# Altium schematic sheet Microcontrolador.SchDoc
size Legal; SheetNumber: 3; SheetTotal: 8
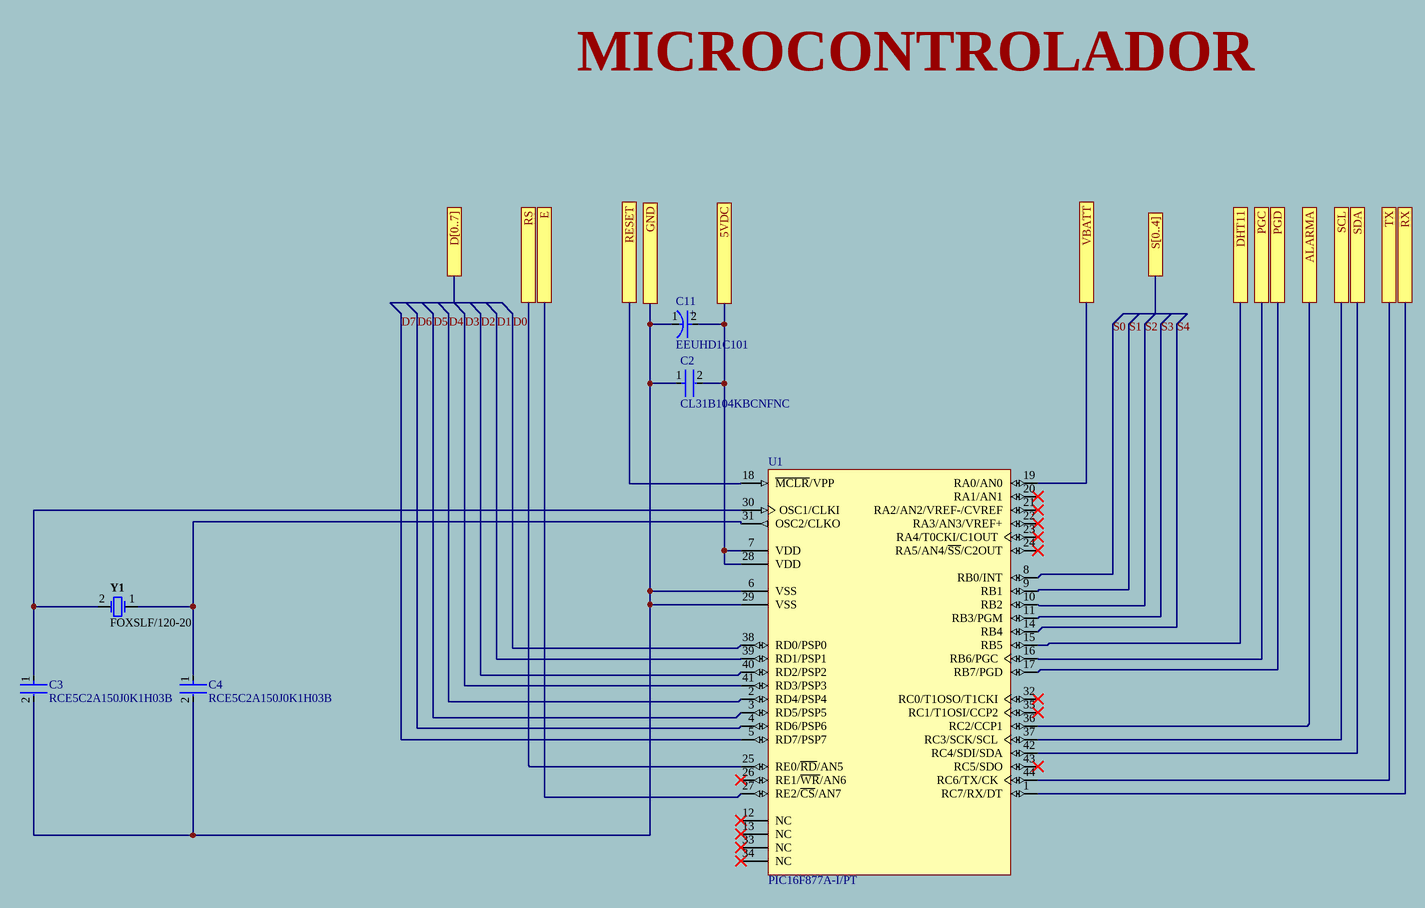
[diagram p0: Microcontrolador.SchDoc]

## Parts
C2  CL31B104KBCNFNC  [FP-CL31-IPC_C]
C3  RCE5C2A150J0K1H03B  [FP-RCE0K1-MFG]
C4  RCE5C2A150J0K1H03B  [FP-RCE0K1-MFG]
C11  EEUHD1C101  [FP-RAD-TH-D_5_0_5-L_11_1-MFG]
U1  PIC16F877A-I/PT  [TQFP-PT44_M]
Y1  FOXSLF/120-20  [FOX-FOXSLF-2_V]

## Ports
5VDC, ALARMA, D[0..7], DHT11, E, GND, PGC, PGD, RESET, RS, RX, S[0..4], SCL, SDA, TX, VBATT

## Nets
5VDC: C2.2 C11.2(A) U1.7(VDD) U1.28(VDD) ; port 5VDC
ALARMA: U1.36(RC2/CCP1) ; port ALARMA
D0: U1.38(RD0/PSP0)
D1: U1.39(RD1/PSP1)
D2: U1.40(RD2/PSP2)
D3: U1.41(RD3/PSP3)
D4: U1.2(RD4/PSP4)
D5: U1.3(RD5/PSP5)
D6: U1.4(RD6/PSP6)
D7: U1.5(RD7/PSP7)
DHT11: U1.15(RB5) ; port DHT11
E: U1.27(RE2/~{CS}/AN7) ; port E
GND: C2.1 C3.2 C4.2 C11.1(C) U1.6(VSS) U1.29(VSS) ; port GND
PGC: U1.16(RB6/PGC) ; port PGC
PGD: U1.17(RB7/PGD) ; port PGD
RESET: U1.18(~{MCLR}/VPP) ; port RESET
RS: U1.25(RE0/~{RD}/AN5) ; port RS
RX: U1.1(RC7/RX/DT) ; port RX
S0: U1.8(RB0/INT)
S1: U1.9(RB1)
S2: U1.10(RB2)
S3: U1.11(RB3/PGM)
S4: U1.14(RB4)
SCL: U1.37(RC3/SCK/SCL) ; port SCL
SDA: U1.42(RC4/SDI/SDA) ; port SDA
TX: U1.44(RC6/TX/CK) ; port TX
VBATT: U1.19(RA0/AN0) ; port VBATT
NetC3_1: C3.1 U1.30(OSC1/CLKI) Y1.2
NetC4_1: C4.1 U1.31(OSC2/CLKO) Y1.1

Not connected (* = marked no-connect by the designer): U1 12(NC)* 13(NC)* 20(RA1/AN1)* 21(RA2/AN2/VREF-/CVREF)* 22(RA3/AN3/VREF+)* 23(RA4/T0CKI/C1OUT)* 24(RA5/AN4/~{SS}/C2OUT)* 26(RE1/~{WR}/AN6)* 32(RC0/T1OSO/T1CKI)* 33(NC)* 34(NC)* 35(RC1/T1OSI/CCP2)* 43(RC5/SDO)*

## Notes on the sheet
- MICROCONTROLADOR
- (in symbol CMP-05427-000949-1) +

## Library data of the parts
C2 = CMP-13271-001276-1: Cap Ceramic 100nF 50V X7R ±10% SMD 1206 +125°C Embossed T/R; Dielectric: X7R; Case Code (Metric): 3216; Package Quantity: 1; Thickness: 0.037inch; Depth: 1.6mm; Packaging: Tape and Reel; Capacitance: 100nF; Length: 0.126inch; Tolerance: 10%; Voltage Rating: 50V; Case Code (Imperial): 1206; Radiation Hardening: No; Width: 0.063inch; Case/Package: 1206; Max Operating Temperature: 125°C; Min Operating Temperature: -55°C; Height: 0.85mm; Mount: Surface Mount
C3 C4 = CMP-06035-032591-1: Cap Ceramic 15pF 100V C0G ±5% Radial 5mm +125°C Automotive Bulk; Lead Diameter: 0.5mm; Lead/Base Style: Formed Leads; Resistor Type: Ceramic; Termination: Radial; Packaging: Bulk; Height: 3.5mm; Voltage Rating (DC): 100V; Height - Seated (Max): 0.138inch; Capacitance: 15pF; Length: 0.142inch; Width: 2.5mm; Ratings: AEC-Q200; Voltage Rating: 100V; Min Operating Temperature: -55°C; Max Operating Temperature: 125°C; Tolerance: 5%; Dielectric: C0G; Case/Package: Radial; Package Quantity: 500; Lead Pitch: 0.197inch; Mount: Through Hole; Lead Free: Lead Free
C11 = CMP-05427-000949-1: Aluminum Electrolytic Capacitors (Radial Lead Type) AEC-Q200 Qualified 100uF ±20% 16V; Lead/Base Style: Straight; Life (Hours): 1000Hour; Polarity: Polar; Ripple Current: 110mA; Lead Diameter: 0.5mm; Packaging: Bulk; Tolerance: 20%; Package Quantity: 200; Lead Pitch: 2.5mm; RoHS Compliant: Yes; Length: 11mm; Capacitance: 100uF; Max Operating Temperature: 105°C; REACH SVHC: No SVHC; Termination: Radial; Lead Free: Lead Free; Number of Pins: 2; Ripple Current (AC): 110mA; Mount: Through Hole; Diameter: 5mm; Min Operating Temperature: -55°C; Construction: RADIAL; Voltage Rating: 16V; Voltage Rating (DC): 16V; Case/Package: Radial; Height: 11mm; Height - Seated (Max): 0.492inch; Voltage: 16V; Series: HD
U1 = CMP-0115-00678-1: Enhanced FLASH Microcontroller, 8K (x14-Bit words) FLASH, 368 Bytes RAM, 44-Pin TQFP, Standard VDD Range, Industrial Temperature; ComponentAvailability: Unknown. Contact manufacturer to determine status.; DatasheetVersion: revB, Oct-2003; Code_JEDEC: MS-026; PackageVersion: revBB, Aug-2009; PackageReference: TQFP-PT44; PackageDescription: 44-Lead Plastic Thin Quad Flatpack (PT) - 10x10x1mm Body, 2.00mm [TQFP]
Y1 = CMP-1749-00004-1: Resistance Weld Thru-Hole Crystal, 12 MHz, +/-30 ppm, -20 to 70 degC, 2-Pin THD, RoHS, Bulk; Elements: 1; Rds On Max: 115 mohm; Typical Rise Time: 90 ns; Max Power Dissipation: 2.5 W; Case\Package: TO-251-3; Input Capacitance: 350 pF; REACH SVHC: No SVHC; Length: 6.6 mm; ComponentLink1URL: http://www.foxonline.com/; PackageDescription: 2-Pin Through Hole Device, Body 11.35 x 4.65 mm, Pitch 4.88 mm; Radiation Hardening: No; Package Quantity: 70; Packaging: Rail/Tube; ComponentLink1Description: Manufacturer URL; Min Operating Temperature: -55 degC; Max Operating Temperature: 150 degC; RoHSCompliant: true; PackageReference: FOXSLF-2; DatasheetVersion: Mar-15; Pins: 3; Height: 6.1 mm; Mount: Through Hole; ComponentLink2URL: http://www.foxonline.com/pdfs/hc49slf.pdf; ComponentLink2Description: Datasheet; Width: 2.3 mm